# Altium schematic sheet Microcontroller.SchDoc
size C; DrawnBy: Ross Harvey; Revision: A; SheetNumber: 1
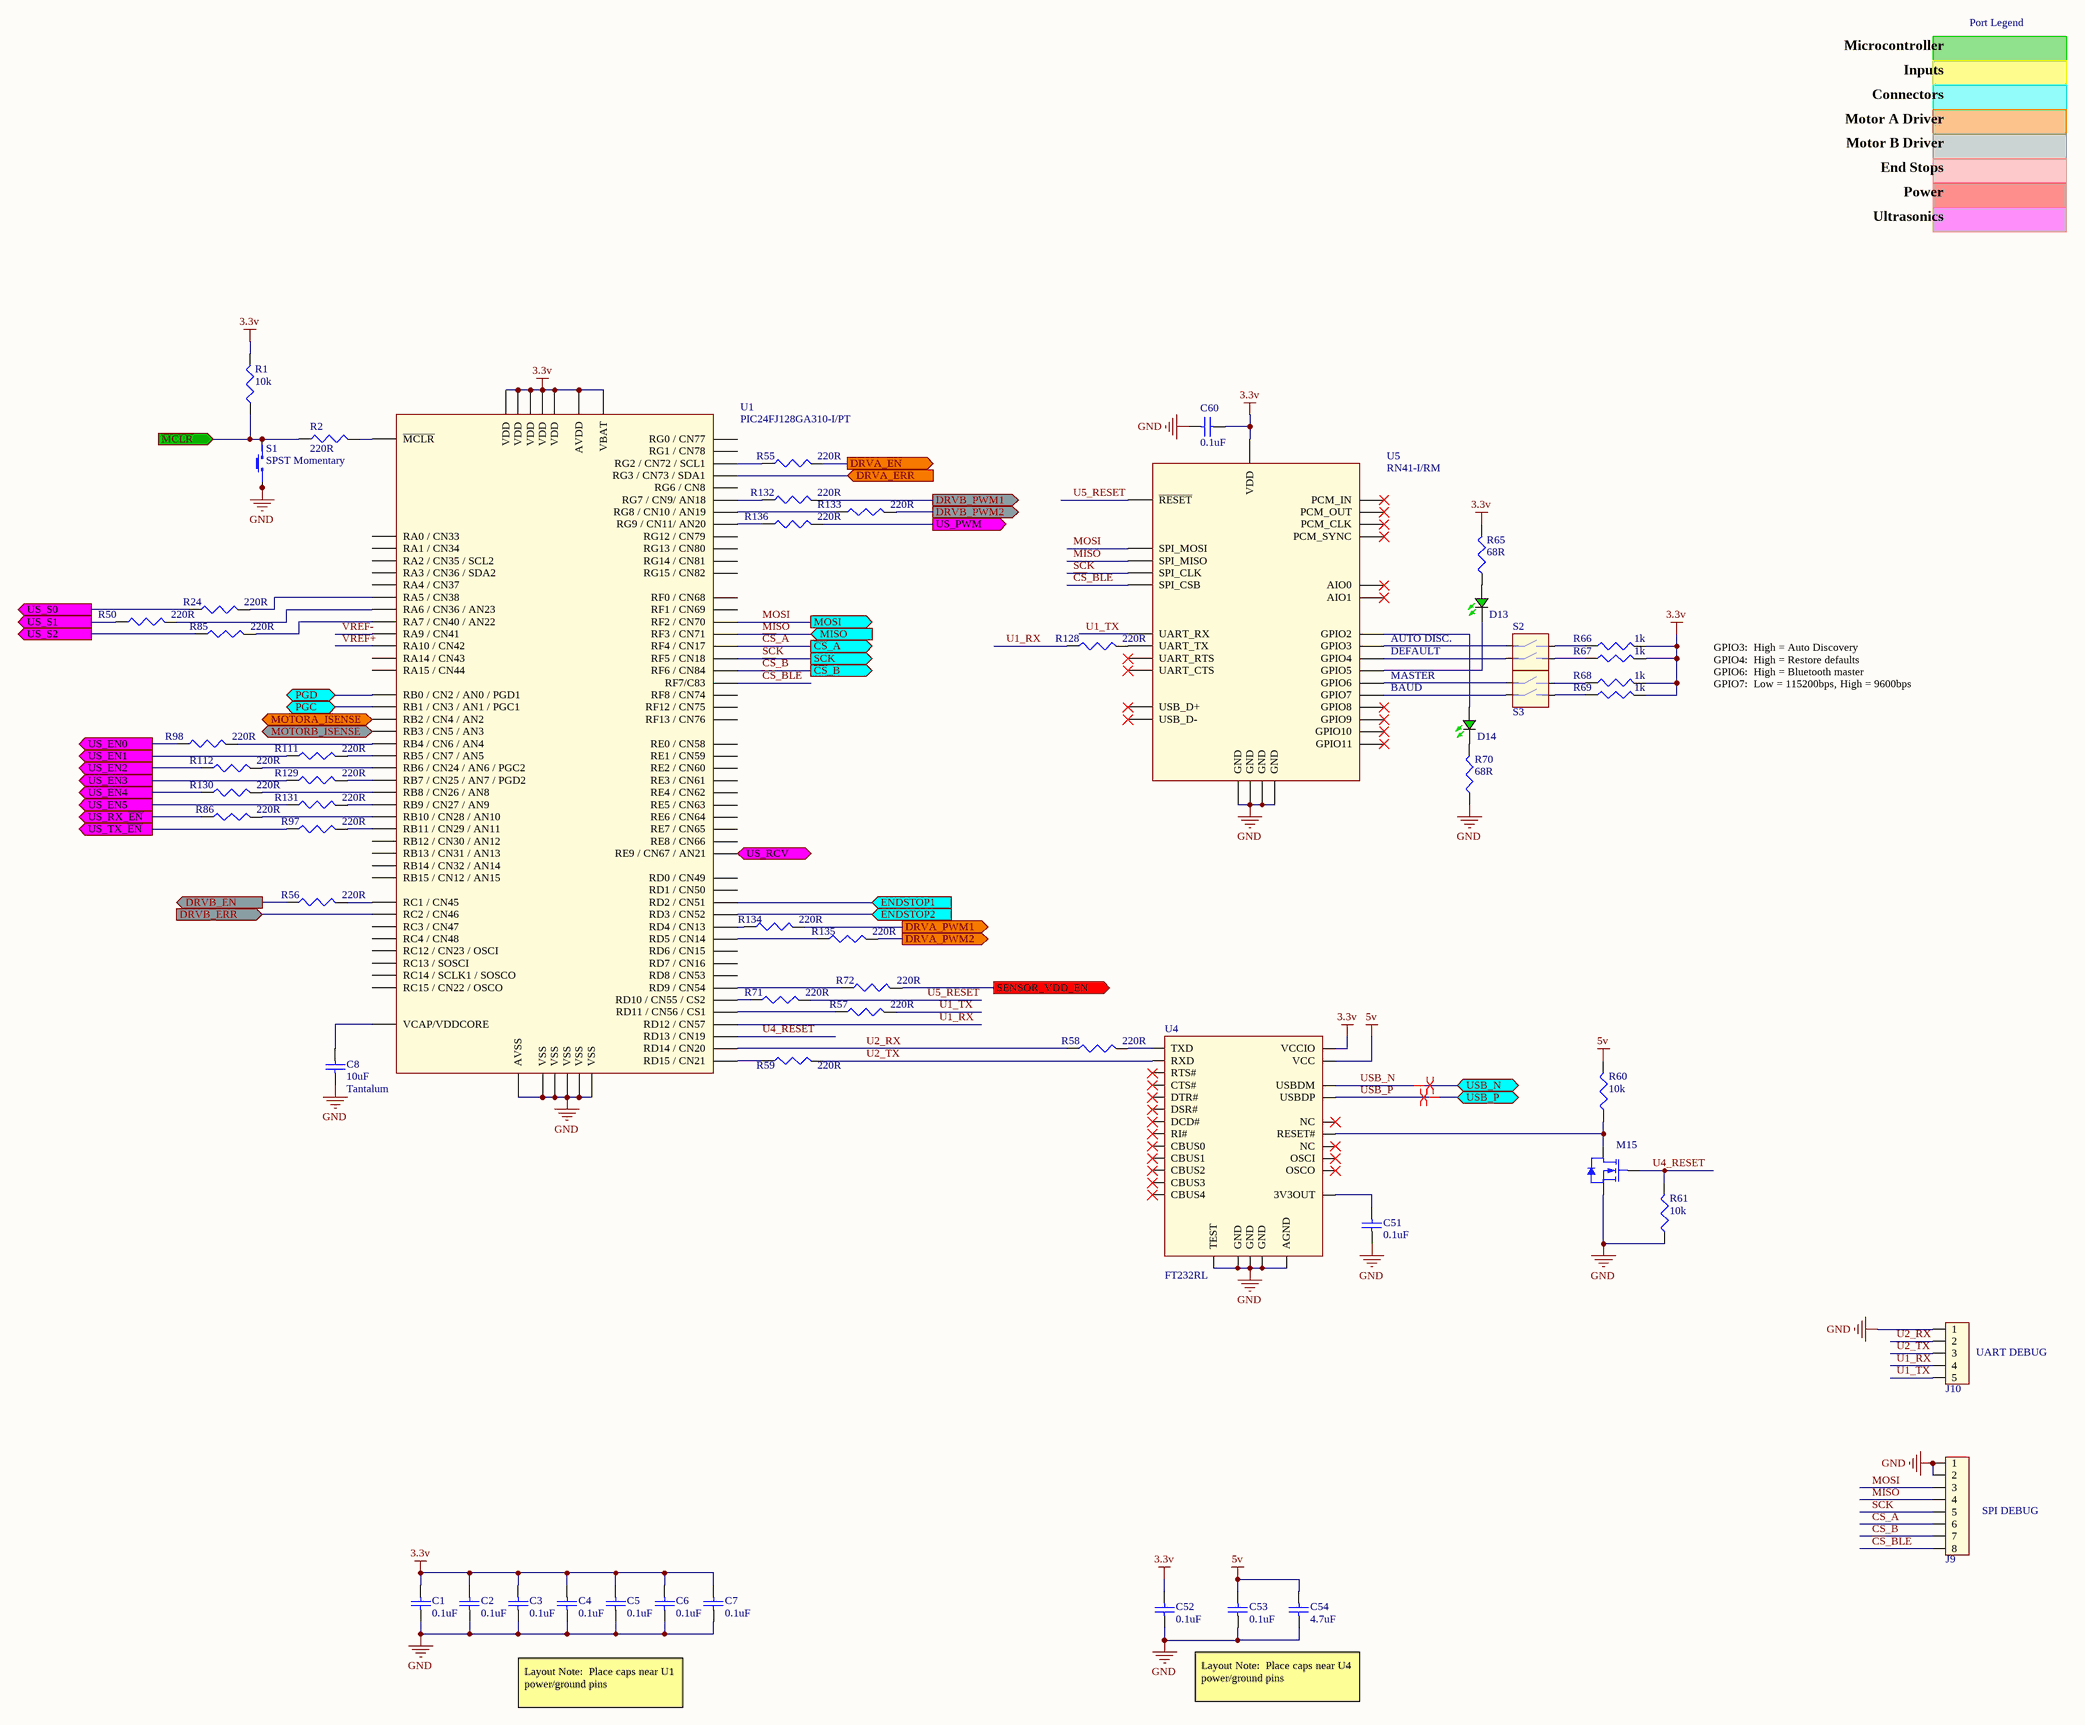
[diagram p0: Microcontroller.SchDoc]

## Parts
C1  0.1uF  [CAP0603W]
C2  0.1uF  [CAP0603W]
C3  0.1uF  [CAP0603W]
C4  0.1uF  [CAP0603W]
C5  0.1uF  [CAP0603W]
C6  0.1uF  [CAP0603W]
C7  0.1uF  [CAP0603W]
C8  Type: Tantalum  [CAP1206W]  (hidden comment: 10uF)
C51  0.1uF  [CAP0603W]
C52  0.1uF  [CAP0603W]
C53  0.1uF  [CAP0603W]
C54  4.7uF  [CAP1206W]
C60  0.1uF  [CAP0603W]
D13  LTST-S270KGKT  [LED Green 0603]  (value not drawn)
D14  LTST-S270KGKT  [LED Green 0603]  (value not drawn)
J9  1x8 Header  [1x8 Header]  (value not drawn)
J10  1x5 Header  [1x5 Header]  (value not drawn)
M15  2N7002P,215  [SOT23-3M]  (value not drawn)
R1  10k  [RES0603W]
R2  220R  [RES0603W]
R24  220R  [RES0603W]
R50  220R  [RES0603W]
R55  220R  [RES0603W]
R56  220R  [RES0603W]
R57  220R  [RES0603W]
R58  220R  [RES0603W]
R59  220R  [RES0603W]
R60  10k  [RES0603W]
R61  10k  [RES0603W]
R65  68R  [RES0603W]
R66  1k  [RES0603W]
R67  1k  [RES0603W]
R68  1k  [RES0603W]
R69  1k  [RES0603W]
R70  68R  [RES0603W]
R71  220R  [RES0603W]
R72  220R  [RES0603W]
R85  220R  [RES0603W]
R86  220R  [RES0603W]
R97  220R  [RES0603W]
R98  220R  [RES0603W]
R111  220R  [RES0603W]
R112  220R  [RES0603W]
R128  220R  [RES0603W]
R129  220R  [RES0603W]
R130  220R  [RES0603W]
R131  220R  [RES0603W]
R132  220R  [RES0603W]
R133  220R  [RES0603W]
R134  220R  [RES0603W]
R135  220R  [RES0603W]
R136  220R  [RES0603W]
S1  SPST Momentary  [TECONN_1571563]
S2  SPST  [CTS_219-2MST]  (value not drawn)
S3  SPST  [CTS_219-2MST]  (value not drawn)
U1  PIC24FJ128GA310-I/PT  [TQFP100 0.4mm Pitch]
U4  FT232RL  [SSOP-28]
U5  RN41-I/RM  [RN41]

## Ports
DRVA_EN (out), DRVA_ERR (in), DRVA_PWM1 (out), DRVA_PWM2 (out), DRVB_EN (out), DRVB_ERR (in), DRVB_PWM1 (out), DRVB_PWM2 (out), ENDSTOP1 (in), ENDSTOP2 (in), MISO (in), MOSI (out), MOTORA_ISENSE (in), MOTORB_ISENSE (in), PGC (bidir), PGD (bidir), SCK (out), SENSOR_VDD_EN (out), US_EN0 (out), US_EN1 (out), US_EN2 (out), US_EN3 (out), US_EN4 (out), US_EN5 (out), US_PWM (out), US_RCV (in), US_RX_~{EN} (out), US_S0 (out), US_S1 (out), US_S2 (out), US_TX_~{EN} (out), USB_N (bidir), USB_P (bidir), ~{CS}_A (out), ~{CS}_B (out), ~{MCLR} (in)

## Nets
3.3v: C1.1 C2.1 C3.1 C4.1 C5.1 C6.1 C7.1 C52.1 C60.2 R1.2 R65.2 R66.2 R67.2 R68.2 R69.2 U1.2(VDD) U1.16(VDD) U1.30(AVDD) U1.37(VDD) U1.46(VDD) U1.62(VDD) U1.86(VBAT) U4.4(VCCIO) U5.11(VDD)
5v: C53.1 C54.1 R60.2 U4.20(VCC)
GND: C1.2 C2.2 C3.2 C4.2 C5.2 C6.2 C7.2 C8.2 C51.2 C52.2 C53.2 C54.2 C60.1 J9.1 J9.2 J10.1 M15.2(SOURCE) R61.1 R70.1 S1.1 S1.2 U1.15(VSS) U1.31(AVSS) U1.36(VSS) U1.45(VSS) U1.65(VSS) U1.75(VSS) U4.7(GND) U4.18(GND) U4.21(GND) U4.25(AGND) U4.26(TEST) U5.1(GND) U5.12(GND) U5.28(GND) U5.29(GND)
~{CS}_A: J9.6 U1.49(RF4_/_CN17) ; port ~{CS}_A
~{CS}_B: J9.7 U1.55(RF6_/_CN84) ; port ~{CS}_B
~{CS}_BLE: J9.8 U1.54(RF7/C83) U5.23(SPI_CSB)
DRVA_EN: R55.2 ; port DRVA_EN
DRVA_ERR: U1.56(RG3_/_CN73_/_SDA1) ; port DRVA_ERR
DRVA_PWM1: R134.2 ; port DRVA_PWM1
DRVA_PWM2: R135.2 ; port DRVA_PWM2
DRVB_EN: R56.1 ; port DRVB_EN
DRVB_ERR: U1.7(RC2_/_CN46) ; port DRVB_ERR
DRVB_PWM1: R132.2 ; port DRVB_PWM1
DRVB_PWM2: R133.2 ; port DRVB_PWM2
ENDSTOP1: U1.77(RD2_/_CN51) ; port ENDSTOP1
ENDSTOP2: U1.78(RD3_/_CN52) ; port ENDSTOP2
~{MCLR}: R1.1 R2.1 S1.3 S1.4 ; port ~{MCLR}
MISO: J9.4 U1.51(RF3_/_CN71) U5.24(SPI_MISO) ; port MISO
MOSI: J9.3 U1.52(RF2_/_CN70) U5.2(SPI_MOSI) ; port MOSI
MOTORA_ISENSE: U1.23(RB2_/_CN4_/_AN2) ; port MOTORA_ISENSE
MOTORB_ISENSE: U1.22(RB3_/_CN5_/_AN3) ; port MOTORB_ISENSE
PGC: U1.24(RB1_/_CN3_/_AN1_/_PGC1) ; port PGC
PGD: U1.25(RB0_/_CN2_/_AN0_/_PGD1) ; port PGD
SCK: J9.5 U1.50(RF5_/_CN18) U5.6(SPI_CLK) ; port SCK
SENSOR_VDD_EN: R72.2 ; port SENSOR_VDD_EN
U1_RX: J10.4 R128.1 U1.79(RD12_/_CN57)
U1_TX: J10.5 R57.2 U5.13(UART_RX)
U2_RX: J10.2 R58.1 U1.47(RD14_/_CN20)
U2_TX: J10.3 R59.2 U4.5(RXD)
U4_RESET: M15.1(GATE) R61.2 U1.80(RD13_/_CN19)
U5_RESET: R71.2 U5.5(~{RESET})
US_EN0: R98.1 ; port US_EN0
US_EN1: R111.1 ; port US_EN1
US_EN2: R112.1 ; port US_EN2
US_EN3: R129.1 ; port US_EN3
US_EN4: R130.1 ; port US_EN4
US_EN5: R131.1 ; port US_EN5
US_PWM: R136.2 ; port US_PWM
US_RCV: U1.19(RE9_/_CN67_/_AN21) ; port US_RCV
US_RX_~{EN}: R86.1 ; port US_RX_~{EN}
US_S0: R24.1 ; port US_S0
US_S1: R50.1 ; port US_S1
US_S2: R85.1 ; port US_S2
US_TX_~{EN}: R97.1 ; port US_TX_~{EN}
USB_N: U4.16(USBDM) ; port USB_N
USB_P: U4.15(USBDP) ; port USB_P
VREF+: U1.29(RA10_/_CN42)
VREF-: U1.28(RA9_/_CN41)
NetC8_1: C8.1 U1.85(VCAP/VDDCORE)
NetC51_1: C51.1 U4.17(3V3OUT)
NetD13_1: D13.1(K) U5.21(GPIO5)
NetD13_2: D13.2(A) R65.1
NetD14_1: D14.1(K) R70.2
NetD14_2: D14.2(A) U5.19(GPIO2)
NetM15_3: M15.3(SOURCE) R60.1 U4.19(RESET#)
NetR2_2: R2.2 U1.13(~{MCLR})
NetR24_2: R24.2 U1.61(RA5_/_CN38)
NetR50_2: R50.2 U1.91(RA6_/_CN36_/_AN23)
NetR55_1: R55.1 U1.57(RG2_/_CN72_/_SCL1)
NetR56_2: R56.2 U1.6(RC1_/_CN45)
NetR57_1: R57.1 U1.71(RD11_/_CN56_/_CS1)
NetR58_2: R58.2 U4.1(TXD)
NetR59_1: R59.1 U1.48(RD15_/_CN21)
NetR66_1: R66.1 S2.2
NetR67_1: R67.1 S2.4
NetR68_1: R68.1 S3.2
NetR69_1: R69.1 S3.4
NetR71_1: R71.1 U1.70(RD10_/_CN55_/_CS2)
NetR72_1: R72.1 U1.69(RD9_/_CN54)
NetR85_2: R85.2 U1.92(RA7_/_CN40_/_AN22)
NetR86_2: R86.2 U1.34(RB10_/_CN28_/_AN10)
NetR97_2: R97.2 U1.35(RB11_/_CN29_/_AN11)
NetR98_2: R98.2 U1.21(RB4_/_CN6_/_AN4)
NetR111_2: R111.2 U1.20(RB5_/_CN7_/_AN5)
NetR112_2: R112.2 U1.26(RB6_/_CN24_/_AN6_/_PGC2)
NetR128_2: R128.2 U5.14(UART_TX)
NetR129_2: R129.2 U1.27(RB7_/_CN25_/_AN7_/_PGD2)
NetR130_2: R130.2 U1.32(RB8_/_CN26_/_AN8)
NetR131_2: R131.2 U1.33(RB9_/_CN27_/_AN9)
NetR132_1: R132.1 U1.11(RG7_/_CN9/_AN18)
NetR133_1: R133.1 U1.12(RG8_/_CN10_/_AN19)
NetR134_1: R134.1 U1.81(RD4_/_CN13)
NetR135_1: R135.1 U1.82(RD5_/_CN14)
NetR136_1: R136.1 U1.14(RG9_/_CN11/_AN20)
NetS2_1: S2.1 U5.20(GPIO3)
NetS2_3: S2.3 U5.22(GPIO4)
NetS3_1: S3.1 U5.3(GPIO6)
NetS3_3: S3.3 U5.4(GPIO7)

Not connected (* = marked no-connect by the designer): U1 1(RG15_/_CN82) 3(RE5_/_CN63) 4(RE6_/_CN64) 5(RE7_/_CN65) 8(RC3_/_CN47) 9(RC4_/_CN48) 10(RG6_/_CN8) 17(RA0_/_CN33) 18(RE8_/_CN66) 38(RA1_/_CN34) 39(RF13_/_CN76) 40(RF12_/_CN75) 41(RB12_/_CN30_/_AN12) 42(RB13_/_CN31_/_AN13) 43(RB14_/_CN32_/_AN14) 44(RB15_/_CN12_/_AN15) 53(RF8_/_CN74) 58(RA2_/_CN35_/_SCL2) 59(RA3_/_CN36_/_SDA2) 60(RA4_/_CN37) 63(RC12_/_CN23_/_OSCI) 64(RC15_/_CN22_/_OSCO) 66(RA14_/_CN43) 67(RA15_/_CN44) 68(RD8_/_CN53) 72(RD0_/_CN49) 73(RC13_/_SOSCI) 74(RC14_/_SCLK1_/_SOSCO) 76(RD1_/_CN50) 83(RD6_/_CN15) 84(RD7_/_CN16) 87(RF0_/_CN68) 88(RF1_/_CN69) 89(RG1_/_CN78) 90(RG0_/_CN77) 93(RE0_/_CN58) 94(RE1_/_CN59) 95(RG14_/_CN81) 96(RG12_/_CN79) 97(RG13_/_CN80) 98(RE2_/_CN60) 99(RE3_/_CN61) 100(RE4_/_CN62); U4 2(DTR#)* 3(RTS#)* 6(RI#)* 8(NC)* 9(DSR#)* 10(DCD#)* 11(CTS#)* 12(CBUS4)* 13(CBUS2)* 14(CBUS3)* 22(CBUS1)* 23(CBUS0)* 24(NC)* 27(OSCI)* 28(OSCO)*; U5 7(PCM_CLK)* 8(PCM_SYNC)* 9(PCM_IN)* 10(PCM_OUT)* 15(UART_RTS)* 16(UART_CTS)* 17(USB_D+)* 18(USB_D-)* 30(AIO0)* 31(GPIO8)* 32(GPIO9)* 33(GPIO10)* 34(GPIO11)* 35(AIO1)*

## Layout directives
differential pair: USB_N, USB_P

## Notes on the sheet
- Port Legend
- Microcontroller
- Inputs
- Connectors
- Motor A Driver
- Motor B Driver
- End Stops
- Power
- Ultrasonics
- AUTO DISC.
- (near U5) DEFAULT
- (near U5) BAUD
- (near U5) MASTER
- GPIO3:  High = Auto Discovery
  GPIO4:  High = Restore defaults
  GPIO6:  High = Bluetooth master
  GPIO7:  Low = 115200bps, High = 9600bps
- (near J10) UART DEBUG
- (near J9) SPI DEBUG
- Layout Note:  Place caps near U4 power/ground pins
- Layout Note:  Place caps near U1 power/ground pins

## Library data of the parts
C1-C7 C51-C53 C60 = 0.1uF: MFG1_PN: VJ0603Y104JXJPW1BC; MFG1: Vishay; Value: 0.1uF
C8 = 10uF Tantalum: MFG1_PN: 293D106X96R3A2TE3; MFG1: Vishay; Value: 10uF
C54 = 4.7uF: MFG1_PN: VJ1206V475ZXJTW1BC; MFG1: Vishay; Voltage: 16v; Value: 4.7uF
D13 D14 = LED Green 0603: MFG: Lite On; VFORWARD: 2v; CURRENT: 20mA; COLOR: Green; MFG_PN: LTST-S270KGKT
J9 = 1x8 Header: 1x8 Header, 2.52mm pitch
J10 = 1x5 Header: 1x5 Header, 2.52mm pitch
M15 = 2N7002: NFET_SINGLE_360mA_60V; LOAD: NL; MFG: NXP; VDS_MAX: 60v; I_MAX: 360mA; VGS_MAX: 20v; P_MAX: *; RDS_ON: *; MFG_PN: 2N7002P,215
R1 R60 R61 = 10K (0603): Tolerance: 1%; POWER: 0.1W; MFG_PN: CRCW060310K0FKEA; MFG: Vishay; Load: NL; Value: 10k
R2 R24 R50 R55-R59 R71 R72 R85 R86 R97 R98 R111 R112 R128-R136 = 220R (0603): Tolerance: 1%; POWER: 0.1W; MFG_PN: CRCW0603220RFKEB; MFG: Vishay; Load: NL; Value: 220R
R65 R70 = 68R (0603): Tolerance: 1%; POWER: 0.1W; MFG_PN: CRCW060368R0FKEB; MFG: Vishay; Load: NL; Value: 68R
R66-R69 = 1k (0603): Tolerance: 1%; POWER: 0.1W; MFG_PN: CRCW06031K00FKEA; MFG: Vishay; Load: NL; Value: 1k
S1 = SPST Momentary: SPST Momentary Switch; MFG: TE Connectivity; MFG_PN: 1571563-1; TYPE: SPST Momentary
S2 S3 = 2xSPST Microswitch: SPST Microswitch Array (2 Switches); MFG: CTS; MFG_PN: 219-2MST; TYPE: SPST
U1 = PIC24FJ128GA310: MFG: Microchip; MFG_PN: PIC24FJ128GA310-I/PT
U4 = FT232RL: UART Interface/Bridge; MFG: FTDI; MFG_PN: FT232RL
U5 = RN41: 2.4GHz Class 1 Bluetooth Module; MFG: MICROCHIP; MFG_PN: RN41-I/RM